# EAGLE design LED Flasher Circuit (EAGLE 4.09)
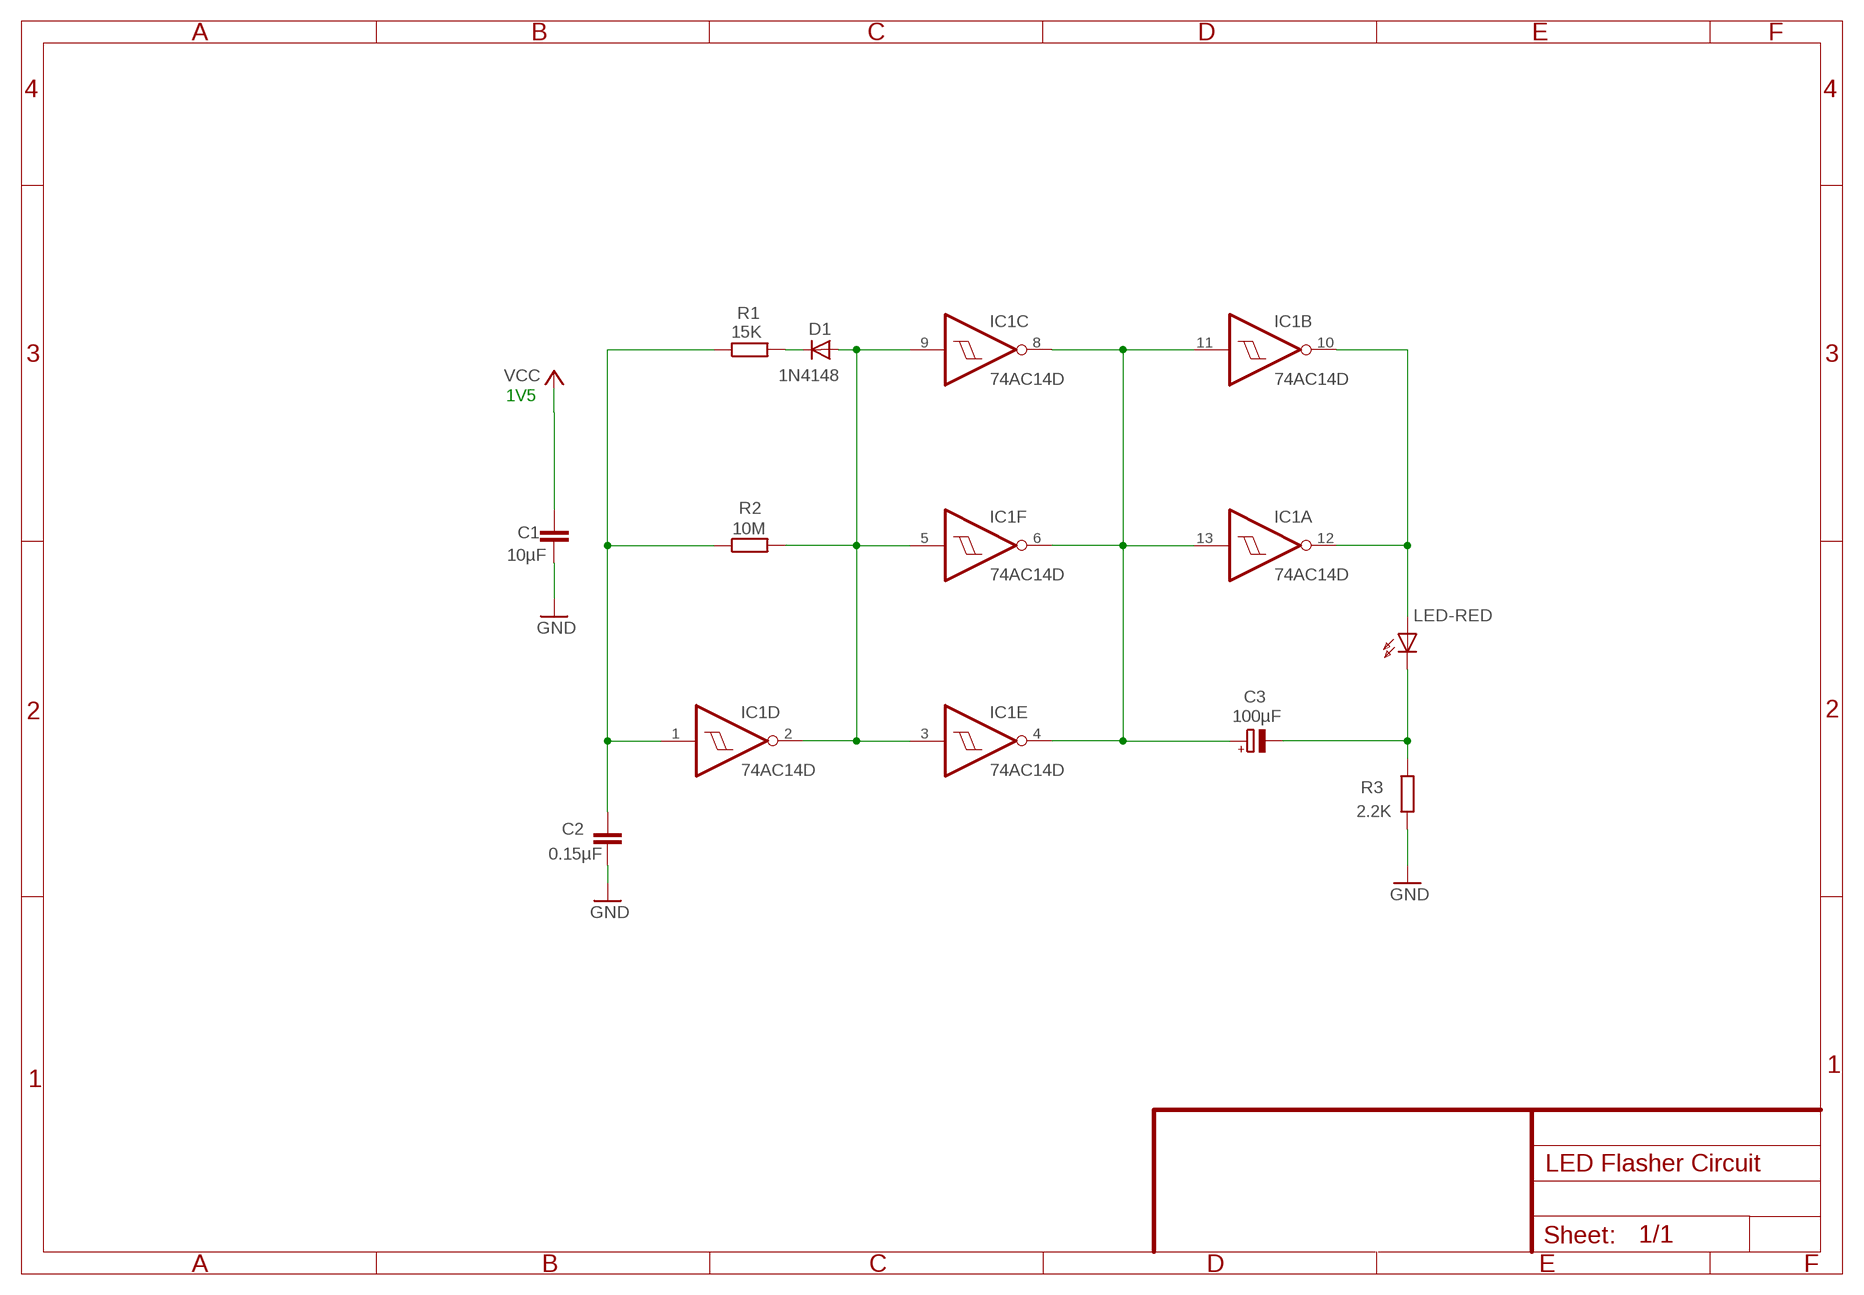
[diagram p0: schematic, sheet 1]

## Parts
C1  10µF  C-EUC1206  [C1206]
C2  0.15µF  C-EUC1206  [C1206]
C3  100µF  CPOL-EU085CS-1AW  [085CS_1AW]
D1  1N4148  DIODE-SOD80C  [SOD80C]
IC1  74AC14D  [SO14]
LED-RED  LEDSMT1206  [1206]
R1  15K  R-EU_M1206  [M1206]
R2  10M  R-EU_M1206  [M1206]
R3  2.2K  R-EU_M1206  [M1206]

## Nets
GND: C1.2 C2.2 R3.1
N$1: C1.1 ; supply symbol labelled VCC
N$2: D1.A IC1.2(D:O) IC1.3(E:I) IC1.5(F:I) IC1.9(C:I) R2.2
N$3: D1.C R1.2
N$4: C2.1 IC1.1(D:I) R1.1 R2.1
N$5: C3.+ IC1.4(E:O) IC1.6(F:O) IC1.8(C:O) IC1.11(B:I) IC1.13(A:I)
N$6: IC1.10(B:O) IC1.12(A:O) LED-RED.A
N$7: C3.- LED-RED.C R3.2

## Notes on the sheet
- 1V5

## Power pins joined to a net without a drawn wire
GND: IC1.7(P:GND)
N$1: IC1.14(P:VCC)

## Library data of the parts
C1 C2 = rcl:C-EU: CAPACITOR, European symbol
C3 = rcl:CPOL-EU: POLARIZED CAPACITOR, European symbol
D1 = diode:DIODE-: DIODE
IC1 = 74xx-eu:74*14: Hex schmitt trigger INVERTER
LED-RED = led:LED: LED
R1-R3 = rcl:R-EU_: RESISTOR, European symbol

## Board
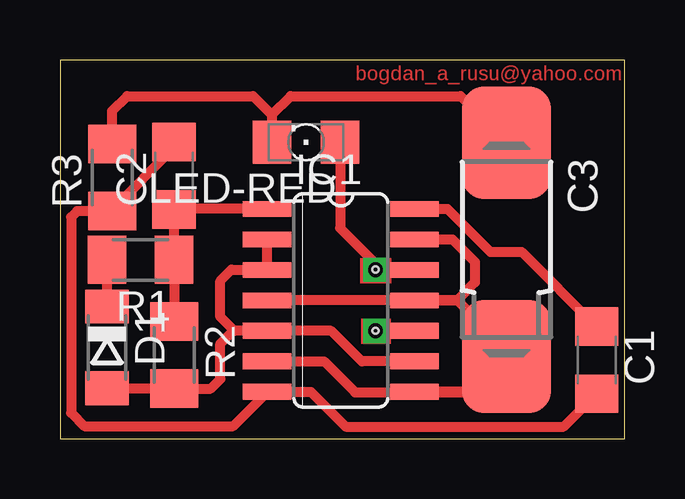
[diagram p1: board, top side]
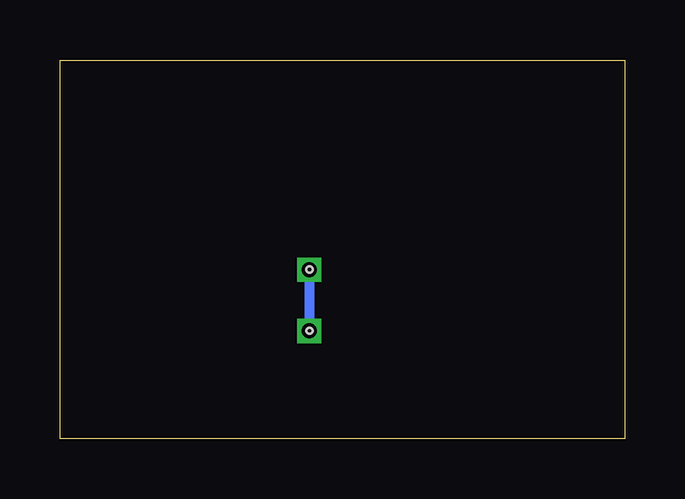
[diagram p2: board, bottom side, seen from below]

Size 23.54 x 15.77 mm. Coordinates in mm from the lower left corner, seen from the top.
Outline: 0,0 23.54,0 23.54,15.77 0,15.77 0,0
Copper layers used: Top, Bottom
Holes 0.25 mm at 13.15,7.04 13.15,4.49

### Footprints (pad centres in the part's own frame; a part is rotated, then mirrored left to right if it is on the bottom)
C1206 = smd 1.6 x 1.8: 1 -1.4,0; 2 1.4,0
085CS_1AW = smd 4.7 x 3.7: + 4.45,0; - -4.45,0
SOD80C = smd 1.4 x 1.8: A 1.7,0; C -1.7,0
SO14 = smd 0.66 x 2.032: 1 -3.81,-3.073; 2 -2.54,-3.073; 3 -1.27,-3.073; 4 0,-3.073; 5 1.27,-3.073; 6 2.54,-3.073; 7 3.81,-3.073; 8 3.81,3.073; 9 2.54,3.073; 10 1.27,3.073; 11 0,3.073; 12 -1.27,3.073; 13 -2.54,3.073; 14 -3.81,3.073
1206 = smd 1.6 x 1.803: A -1.422,0; C 1.422,0
M1206 = smd 1.6 x 2: 1 -1.4,0; 2 1.4,0

### Placement (x,y rotation side)
C1  22.36,3.27 270 top
C2  4.75,10.95 90 top
C3  18.6,7.88 270 top
D1  1.96,3.8 270 top
IC1  11.7,5.76 270 top
LED-RED  10.25,12.35 180 top
R1  3.35,7.44 180 top
R2  4.76,3.48 270 top
R3  2.17,10.88 90 top

### Tracks (layer width: path | path; a pad name or v marks a point on that pad's centre or on a via)
GND
  Top 0.406: C2.2 4.75,12.11 2.15,9.51 R3.1 0.71,9.48 0.46,9.23 0.46,1.07 1.02,0.52 7.21,0.52 IC1.7 10.45,1.95 11.9,0.49 20.99,0.49 C1.2
N$1
  Top 0.406: IC1.14 16.14,9.57 17.94,7.77 19.23,7.77 22.35,4.65 C1.1
N$2
  Top 0.406: IC1.9 12.58,3.22 11.3,4.49 8.67,4.49 8.66,4.49 IC1.5 | IC1.5 7.26,4.49 7.23,4.52 | 7.23,4.52 6.68,5.07 6.68,6.57 7.14,7.04 8.6,7.04 8.62,7.01 IC1.3 8.63,8.24 8.64,8.26 8.63,8.28 IC1.2 | D1.A 4.71,2.1 4.74,2.07 R2.2 6.28,2.08 6.68,2.48 6.68,3.96 7.23,4.52 | IC1.5 8.62,4.47 8.57,4.52 7.23,4.52
N$3
  Top 0.406: R1.2 1.95,7.42 1.99,7.38 1.96,7.36 D1.C
N$4
  Top 0.406: IC1.1 4.79,9.57 4.78,9.55 C2.1 4.75,7.46 4.77,7.44 | 4.81,7.41 4.77,7.44 | 4.77,7.44 R1.1 4.75,4.8 4.76,4.8 | 4.76,4.79 4.76,4.8 | 4.76,4.8 R2.1
N$5
  Top 0.406: IC1.8 | IC1.8 14.84,1.95 14.86,1.93 14.88,1.95 17.03,1.95 | C3.+ 17.12,1.95 17.03,1.95 | 17.03,1.95 IC1.8 | IC1.13 16.35,8.3 17.29,7.36 17.29,6.5 16.55,5.76 | 14.75,5.74 IC1.11 | IC1.11 | 16.55,5.76 14.77,5.76 IC1.11 | 8.62,5.72 8.63,5.73 | 8.63,5.73 IC1.4 8.65,5.76 8.67,5.74 8.69,5.76 16.55,5.76 | IC1.11 8.66,5.76 8.63,5.73 | IC1.11 16.56,5.76 17.5,4.82 17.5,2.41 17.03,1.95 | IC1.6 11.01,3.22 12.3,1.93 17.1,1.93 18.14,2.97 18.14,4.17 16.55,5.76
N$6  (via drill 0.61)
  Top 0.406: LED-RED.A 11.67,8.77 13.41,7.04 14.77,7.04 | 14.79,7.06 14.77,7.04 | 14.77,7.04 IC1.12 v13.15,7.03 | IC1.10 v13.15,4.49 v13.15,4.48
  Bottom 0.406: v13.15,7.03 v13.15,4.48
N$7
  Top 0.406: LED-RED.C 8.83,12.4 8.83,13.48 | R3.2 2.17,13.65 2.8,14.27 8.04,14.27 8.83,13.48 | 8.83,13.48 | 8.83,13.48 9.61,14.27 16.69,14.27 18.63,12.33 C3.-
N$8  (via drill 0.61)
  other vias: 13.15,7.03
N$9  (via drill 0.61)
  other vias: 13.15,4.5
(copper drawn outside any net)
  shapes: Top area x2

### Text on the board
Top: bogdan_a_rusu@yahoo.com